# Altium project BQH_DATN_PI4.PrjPcb
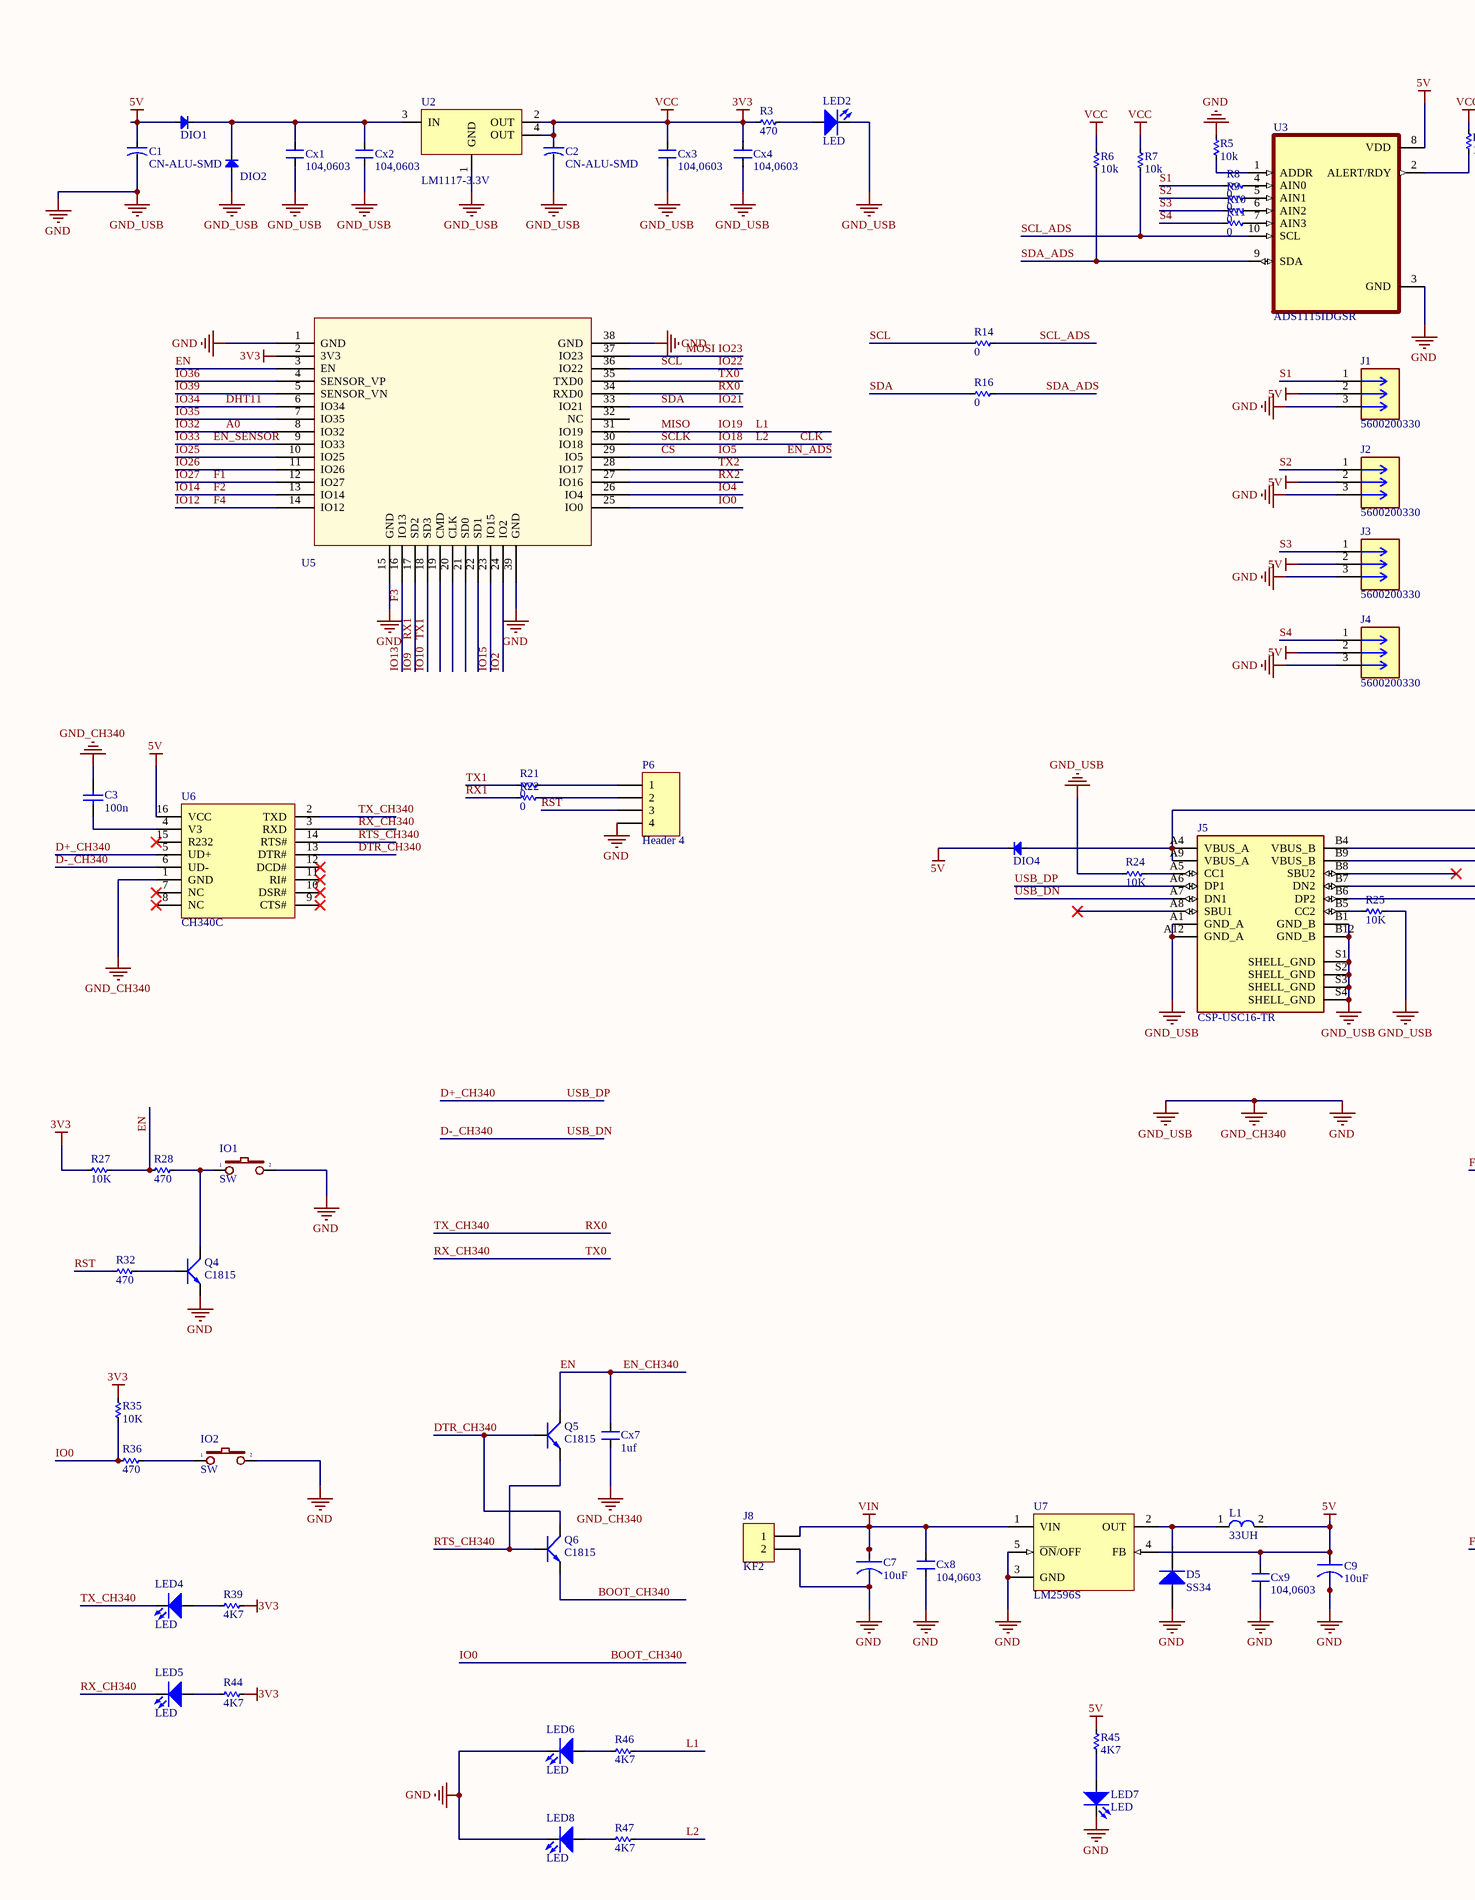
[diagram p0: BQH_DATN_PI4.SchDoc, left]
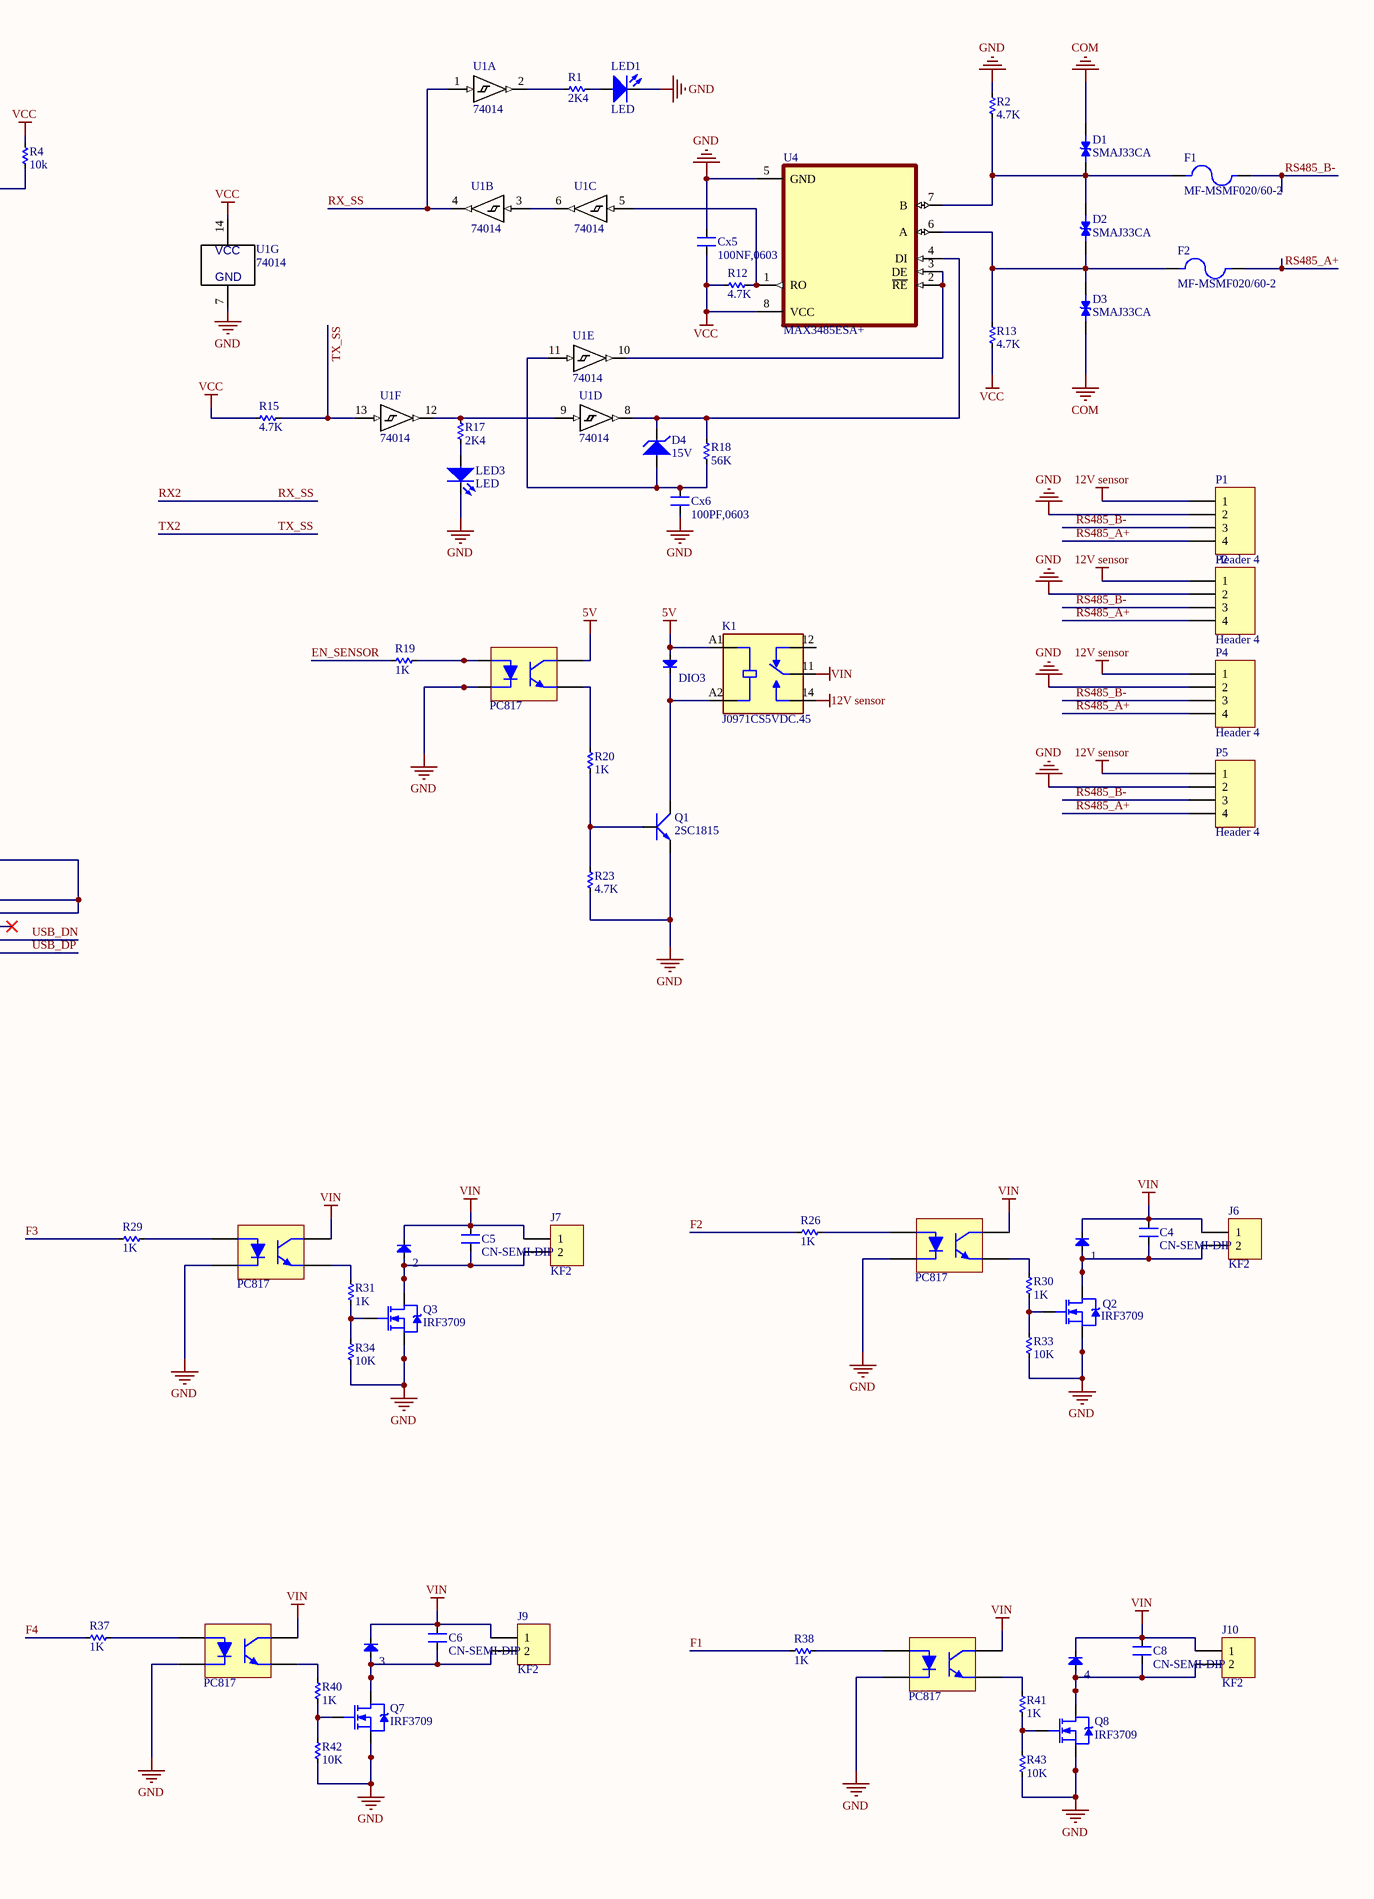
[diagram p1: BQH_DATN_PI4.SchDoc, right]
1 sheet, 127 parts. Net scope: global (net labels, ports and power ports of the same name join across sheets).
Board file: BQH_DATN_PI4.PcbDoc

## Sheet BQH_DATN_PI4.SchDoc
size A2

### Parts
1  Diode SMD  [DIO-SMD-A]  (value not drawn)
2  Diode SMD  [DIO-SMD-A]  (value not drawn)
3  Diode SMD  [DIO-SMD-A]  (value not drawn)
4  Diode SMD  [DIO-SMD-A]  (value not drawn)
C1  CN-ALU-SMD  [CAP-ALU-SMD-6.3x7.7x2.2]
C2  CN-ALU-SMD  [CAP-ALU-SMD-6.3x7.7x2.2]
C3  100n  [CAP SMD 0805.CAOVANHUONG]
C4  CN-SEMI-DIP  [C-SE-10x13x12x6x4]
C5  CN-SEMI-DIP  [C-SE-10x13x12x6x4]
C6  CN-SEMI-DIP  [C-SE-10x13x12x6x4]
C7  10uF  [CAP 8x11.5x3.5mm.CAOVANHUONG]
C8  CN-SEMI-DIP  [C-SE-10x13x12x6x4]
C9  10uF  [CAP 8x11.5x3.5mm.CAOVANHUONG]
Cx1  104,0603  [CN-SMD-3225]
Cx2  104,0603  [CN-SMD-0805]
Cx3  104,0603  [CN-SMD-3225]
Cx4  104,0603  [CN-SMD-0805]
Cx5  100NF,0603  [CN-SMD-0805]
Cx6  100PF,0603  [CN-SMD-0805]
Cx7  1uf  [CN-SMD-0805]
Cx8  104,0603  [CN-SMD-3225]
Cx9  104,0603  [CN-SMD-3225]
D1  SMAJ33CA  [DIOM4325X250N]
D2  SMAJ33CA  [DIOM4325X250N]
D3  SMAJ33CA  [DIOM4325X250N]
D4  15V  [SOD80.CAOVANHUONG]
D5  SS34  [DIODE SMA]
DIO1  Diode SMD  [DIO-SMD-106]  (value not drawn)
DIO2  Diode SMD  [DIO-SMD-106]  (value not drawn)
DIO3  Diode SMD  [DIO-SMD-106]  (value not drawn)
DIO4  Diode SMD  [DIO-SMD-106]  (value not drawn)
F1  MF-MSMF020/60-2  [FUSER_MF-MSMF020/60-2]
F2  MF-MSMF020/60-2  [FUSER_MF-MSMF020/60-2]
IO1  SW  [SW1-SMD]
IO2  SW  [SW1-SMD]
J1  5600200330  [CONN03_560020_MOL]
J2  5600200330  [CONN03_560020_MOL]
J3  5600200330  [CONN03_560020_MOL]
J4  5600200330  [CONN03_560020_MOL]
J5  CSP-USC16-TR  [VALCON_CSP-USC16-TR]
J6  KF2  [KF2-7.62]
J7  KF2  [KF2-7.62]
J8  KF2  [KF2-7.62]
J9  KF2  [KF2-7.62]
J10  KF2  [KF2-7.62]
K1  J0971CS5VDC.45  [RELAY_J0971CS5VDC.45]
L1  33UH  [L-SMD-M-7.3x4.5]
LED1  LED  [LED SMD 0603 RED.CAOVANHUONG]
LED2  LED  [LED SMD 0805 RED witch hole.CAOVANHUONG]
LED3  LED  [LED SMD 0603 RED.CAOVANHUONG]
LED4  LED  [LED SMD 0603 RED.CAOVANHUONG]
LED5  LED  [LED SMD 0603 RED.CAOVANHUONG]
LED6  LED  [LED SMD 0603 RED.CAOVANHUONG]
LED7  LED  [LED SMD 0805 YEL.CAOVANHUONG]
LED8  LED  [LED SMD 0603 RED.CAOVANHUONG]
P1  Header 4  [PCB HEADER 4PIN.CAOVANHUONG]
P2  Header 4  [PCB HEADER 4PIN.CAOVANHUONG]
P3  PC817  [PC817S.CAOVANHUONG]
P4  Header 4  [PCB HEADER 4PIN.CAOVANHUONG]
P5  Header 4  [PCB HEADER 4PIN.CAOVANHUONG]
P6  Header 4  [PCB HEADER 4PIN.CAOVANHUONG]
P7  PC817  [PC817S.CAOVANHUONG]
P8  PC817  [PC817S.CAOVANHUONG]
P9  PC817  [PC817S.CAOVANHUONG]
P10  PC817  [PC817S.CAOVANHUONG]
Q1  2SC1815  [SOT23-321]
Q2  IRF3709  [D2PAK]
Q3  IRF3709  [D2PAK]
Q4  C1815  [SOT23-3.CAOVANHUONG]
Q5  C1815  [SOT23-3.CAOVANHUONG]
Q6  C1815  [SOT23-3.CAOVANHUONG]
Q7  IRF3709  [D2PAK]
Q8  IRF3709  [D2PAK]
R1  2K4  [RES-SMD-0805]
R2  4.7K  [RES-SMD-0805]
R3  470  [RES-SMD-0805]
R4  10k  [RES-SMD-0805]
R5  10k  [RES-SMD-0805]
R6  10k  [RES-SMD-0805]
R7  10k  [RES-SMD-0805]
R8  0  [RES-SMD-0805]
R9  0  [RES-SMD-0805]
R10  0  [RES-SMD-0805]
R11  0  [RES-SMD-0805]
R12  4.7K  [RES-SMD-0805]
R13  4.7K  [RES-SMD-0805]
R14  0  [RES-SMD-0805]
R15  4.7K  [RES-SMD-0805]
R16  0  [RES-SMD-0805]
R17  2K4  [RES-SMD-0805]
R18  56K  [RES-SMD-0805]
R19  1K  [RES-SMD-0805]
R20  1K  [RES-SMD-0805]
R21  0  [RES-SMD-0805]
R22  0  [RES-SMD-0805]
R23  4.7K  [RES-SMD-0805]
R24  10K  [RES-SMD-0805]
R25  10K  [RES-SMD-0805]
R26  1K  [RES-SMD-0805]
R27  10K  [RES-SMD-0805]
R28  470  [RES-SMD-0805]
R29  1K  [RES-SMD-0805]
R30  1K  [RES-SMD-0805]
R31  1K  [RES-SMD-0805]
R32  470  [RES-SMD-0603]
R33  10K  [RES-SMD-0805]
R34  10K  [RES-SMD-0805]
R35  10K  [RES-SMD-0805]
R36  470  [RES-SMD-0805]
R37  1K  [RES-SMD-0805]
R38  1K  [RES-SMD-0805]
R39  4K7  [RES-SMD-0805]
R40  1K  [RES-SMD-0805]
R41  1K  [RES-SMD-0805]
R42  10K  [RES-SMD-0805]
R43  10K  [RES-SMD-0805]
R44  4K7  [RES-SMD-0805]
R45  4K7  [RES-SMD-0805]
R46  4K7  [RES-SMD-0805]
R47  4K7  [RES-SMD-0805]
U1  74014  [SO14]  (parts A,B,C,D,E,F,G of 7)
U2  LM1117-3.3V  [SOT223-4.CAOVANHUONG]
U3  ADS1115IDGSR  [SOP50P490X110-10N]
U4  MAX3485ESA+  [SOIC127P600X175-8N]
U5  ESP32-WROOM-32  [ESP32-WROOM-32D]  (value not drawn)
U6  CH340C  [SOIC16_50_284_25X90_SMT]
U7  LM2596S  [TO263-5.CAOVANHUONG]

### Nets
3V3: C2.1 Cx3.2 Cx4.2 Cx5.1 R3.2 R4.2 R6.2 R7.2 R12.1 R13.2 R15.1 R27.1 R35.1 R39.2 R44.2 U1.14(VCC) U2.2(OUT) U2.4(OUT) U4.8(VCC) U5.2(3V3)  [also labelled VCC]
5V: C1.1 C9.1 Cx9.2 DIO1.1(A) DIO3.1(A) DIO4.2(K) J1.2 J2.2 J3.2 J4.2 K1.A1(COIL1) L1.2 P3.4 R45.2 U3.8(VDD) U6.16(VCC) U7.4(FB)
12V sensor: K1.14(NO) P1.1 P2.1 P4.1 P5.1
COM: D1.2 D3.1
GND: C1.2 C2.2 C3.1 C7.2 C9.2 Cx1.1 Cx2.1 Cx3.1 Cx4.1 Cx5.2 Cx6.2 Cx7.2 Cx8.1 Cx9.1 D5.1(A) DIO2.1(A) IO1.2 IO2.2 J1.3 J2.3 J3.3 J4.3 J5.A1(GND_A) J5.A12(GND_A) J5.B1(GND_B) J5.B12(GND_B) J5.S1(SHELL_GND) J5.S2(SHELL_GND) J5.S3(SHELL_GND) J5.S4(SHELL_GND) J8.2 LED1.2 LED2.2 LED3.2 LED6.2 LED7.2 LED8.2 P1.2 P2.2 P3.2 P4.2 P5.2 P6.4 P7.2 P8.2 P9.2 P10.2 Q1.1(E) Q2.3(S) Q3.3(S) Q4.2(E) Q7.3(S) Q8.3(S) R2.1 R5.2 R23.2 R24.1 R25.2 R33.2 R34.2 R42.2 R43.2 U1.7(GND) U2.1(GND) U3.3(GND) U4.5(GND) U5.1(GND) U5.15(GND) U5.38(GND) U5.39(GND) U6.1(GND) U7.3(GND) U7.5(~{ON}/OFF)  [also labelled GND_CH340, GND_USB]
VIN: 1.2(K) 2.2(K) 3.2(K) 4.2(K) C4.1 C5.1 C6.1 C7.1 C8.1 Cx8.2 J6.1 J7.1 J8.1 J9.1 J10.1 K1.11(COM) P7.4 P8.4 P9.4 P10.4 U7.1(VIN)
A0: U5.8(IO32)  [also labelled IO32]
BOOT_CH340: Q6.2(E) R35.2 R36.2 U5.25(IO0)  [also labelled IO0]
CLK: R47.2 U5.30(IO18)  [also labelled IO18, L2, SCLK]
CS: U5.29(IO5)  [also labelled EN_ADS, IO5]
D+_CH340: J5.A6(DP1) J5.B6(DP2) U6.5(UD+)  [also labelled USB_DP]
D-_CH340: J5.A7(DN1) J5.B7(DN2) U6.6(UD-)  [also labelled USB_DN]
DHT11: U5.6(IO34)  [also labelled IO34]
DTR_CH340: Q5.1(B) Q6.3(C) U6.13(DTR#)
EN: Cx7.1 Q5.3(C) R27.2 R28.1 U5.3(EN)  [also labelled EN_CH340]
EN_SENSOR: R19.2 U5.9(IO33)  [also labelled IO33]
F1: R38.1 U5.12(IO27)  [also labelled IO27]
F2: R26.1 U5.13(IO14)  [also labelled IO14]
F3: R29.1 U5.16(IO13)  [also labelled IO13]
F4: R37.1 U5.14(IO12)  [also labelled IO12]
IO2: U5.24(IO2)
IO4: U5.26(IO4)
IO9: R22.2 U5.17(SD2)  [also labelled RX1]
IO10: R21.2 U5.18(SD3)  [also labelled TX1]
IO15: U5.23(IO15)
IO19: R46.2 U5.31(IO19)  [also labelled L1, MISO]
IO21: R16.2 U5.33(IO21)  [also labelled SDA]
IO22: R14.2 U5.36(IO22)  [also labelled SCL]
IO23: U5.37(IO23)  [also labelled MOSI]
IO25: U5.10(IO25)
IO26: U5.11(IO26)
IO35: U5.7(IO35)
IO36: U5.4(SENSOR_VP)
IO39: U5.5(SENSOR_VN)
RS485_A+: F2.2 P1.4 P2.4 P4.4 P5.4
RS485_B-: F1.2 P1.3 P2.3 P4.3 P5.3
RST: P6.3 R32.1
RTS_CH340: Q5.2(E) Q6.1(B) U6.14(RTS#)
RX0: LED4.2 U5.34(RXD0) U6.2(TXD)  [also labelled TX_CH340]
RX2: U1.1(A) U1.4(Y) U5.27(IO16)  [also labelled RX_SS]
RX_CH340: LED5.2 U5.35(TXD0) U6.3(RXD)  [also labelled TX0]
S1: J1.1 R8.2
S2: J2.1 R9.2
S3: J3.1 R10.2
S4: J4.1 R11.2
SCL_ADS: R7.1 R14.1 U3.10(SCL)
SDA_ADS: R6.1 R16.1 U3.9(SDA)
TX2: R15.2 U1.13(A) U5.28(IO17)  [also labelled TX_SS]
Net1_1: 1.1(A) C4.2 J6.2 Q2.2(D)
Net2_1: 2.1(A) C5.2 J7.2 Q3.2(D)
Net3_1: 3.1(A) C6.2 J9.2 Q7.2(D)
Net4_1: 4.1(A) C8.2 J10.2 Q8.2(D)
NetC3_2: C3.2 U6.4(V3)
NetCx1_2: Cx1.2 Cx2.2 DIO1.2(K) DIO2.2(K) U2.3(IN)
NetCx6_1: Cx6.1 D4.1 R18.2 U1.11(A)
NetD1_1: D1.1 D2.2 F1.1 R2.2 U4.7(B)
NetD2_1: D2.1 D3.2 F2.1 R13.1 U4.6(A)
NetD4_2: D4.2 R18.1 U1.8(Y) U4.4(DI)
NetD5_2: D5.2(K) L1.1 U7.2(OUT)
NetDIO3_2: DIO3.2(K) K1.A2(COIL2) Q1.2(C)
NetDIO4_1: DIO4.1(A) J5.A4(VBUS_A) J5.A9(VBUS_A) J5.B4(VBUS_B) J5.B9(VBUS_B)
NetIO1_1: IO1.1 Q4.3(C) R28.2
NetIO2_1: IO2.1 R36.1
NetJ5_A5: J5.A5(CC1) R24.2
NetJ5_B5: J5.B5(CC2) R25.1
NetLED1_1: LED1.1 R1.2
NetLED2_1: LED2.1 R3.1
NetLED3_1: LED3.1 R17.2
NetLED4_1: LED4.1 R39.1
NetLED5_1: LED5.1 R44.1
NetLED6_1: LED6.1 R46.1
NetLED7_1: LED7.1 R45.1
NetLED8_1: LED8.1 R47.1
NetP3_1: P3.1 R19.1
NetP3_3: P3.3 R20.2
NetP6_1: P6.1 R21.1
NetP6_2: P6.2 R22.1
NetP7_1: P7.1 R26.2
NetP7_3: P7.3 R30.2
NetP8_1: P8.1 R29.2
NetP8_3: P8.3 R31.2
NetP9_1: P9.1 R37.2
NetP9_3: P9.3 R40.2
NetP10_1: P10.1 R38.2
NetP10_3: P10.3 R41.2
NetQ1_3: Q1.3(B) R20.1 R23.1
NetQ2_1: Q2.1(G) R30.1 R33.1
NetQ3_1: Q3.1(G) R31.1 R34.1
NetQ4_1: Q4.1(B) R32.2
NetQ7_1: Q7.1(G) R40.1 R42.1
NetQ8_1: Q8.1(G) R41.1 R43.1
NetR1_1: R1.1 U1.2(Y)
NetR4_1: R4.1 U3.2(ALERT/RDY)
NetR5_1: R5.1 U3.1(ADDR)
NetR8_1: R8.1 U3.4(AIN0)
NetR9_1: R9.1 U3.5(AIN1)
NetR10_1: R10.1 U3.6(AIN2)
NetR11_1: R11.1 U3.7(AIN3)
NetR12_2: R12.2 U1.5(A) U4.1(RO)
NetR17_1: R17.1 U1.9(A) U1.12(Y)
NetU1_3: U1.3(A) U1.6(Y)
NetU1_10: U1.10(Y) U4.2(~{RE}) U4.3(DE)

Not connected (* = marked no-connect by the designer): J5 A8(SBU1)* B8(SBU2)*; K1 12(NC); U5 19(CMD) 20(CLK) 21(SD0) 22(SD1) 32(NC); U6 7(NC)* 8(NC)* 9(CTS#)* 10(DSR#)* 11(RI#)* 12(DCD#)* 15(R232)*

### Library data of the parts
1-4 DIO1-DIO4 = Diode SMD: Default Diode; Code - JEDEC: DO-214-AB; Value: 1N5007; Published: 8-Jun-2000; Revision: July-2002: Re-released for DXP Platform.; Publisher: Altium Limited
C1 C2 = CN-ALU-SMD: Polarized Capacitor (Axial); Published: 8-Jun-2000; LatestRevisionDate: 17-Jul-2002; LatestRevisionNote: Re-released for DXP Platform.; PackageReference: POLAR0.8; Publisher: Altium Limited
C3 = Capacitor NP: Ceramic capacitor; Value: 10uF/50V; Pricing: *; Part Number: *
C4-C6 C8 = CN-SEMI-DIP: Capacitor (Semiconductor SIM Model); Value: 104; LatestRevisionDate: 17-Jul-2002; LatestRevisionNote: Re-released for DXP Platform.; PackageReference: C1206; Publisher: Altium Limited
C7 C9 = Capacitor: Alumium capacitor; Value: 10uF/50V; Part Number: *; Pricing: *
Cx1-Cx9 = CN: Value: 33pF
D1-D3 = SMAJ33CA: 69.7V Clamp 33A (8/20Âµs) Ipp Tvs Diode Surface Mount SMA (DO-214AC); MF: STMicroelectronics; MP: SMAJ33CA-TR; Check_prices: https://www.snapeda.com/parts/SMAJ33CA-TR/STMicroelectronics/view-part/?ref=eda; Purchase-URL: https://pricing.snapeda.com/search/part/SMAJ33CA-TR/?ref=eda; Price: None; SnapEDA_Link: https://www.snapeda.com/parts/SMAJ33CA-TR/STMicroelectronics/view-part/?ref=snap; Availability: In Stock; Package: DO-214 STMicroelectronics; Value: *
D4 = Diode Zener: Part Number: BZV55-C5V1; Pricing: *
D5 = Diode SS34 ( 1N5822 ): Dán; Don_Vi: Con; Ma_Hang: MH002104; Ten_Linh_Kien: Diode SS34 3A 40V SMA ( 1N5822 SS34A); Kieu_Chan: *; Chung_Loai: Dán
F1 F2 = MF-MSMF020/60-2: Polymeric PTC Resettable Fuse 60V 200mA Ih Surface Mount 1812 (4532 Metric), Concave; MF: Bourns; Purchase-URL: https://pricing.snapeda.com/search/part/MF-MSMF020/60-2/?ref=eda; Value: *; Package: 1812 Bourns; Check_prices: https://www.snapeda.com/parts/MF-MSMF020/60-2/Bourns/view-part/?ref=eda; Price: None; Availability: In Stock; MP: MF-MSMF020/60-2; SnapEDA_Link: https://www.snapeda.com/parts/MF-MSMF020/60-2/Bourns/view-part/?ref=snap
IO1 IO2 = SW2: Switch button 2 pin; Value: SW chip 2 pin
J5 = CSP-USC16-TR: CSP-USC16-TR Valcon USB Type C Surface Mount PCB Socket; SnapEDA_Link: https://www.snapeda.com/parts/CSP-USC16-TR/Valcon/view-part/?ref=snap; MF: Valcon; MP: CSP-USC16-TR; Availability: In Stock; Price: None; Value: *; Check_prices: https://www.snapeda.com/parts/CSP-USC16-TR/Valcon/view-part/?ref=eda; Package: None; Purchase-URL: https://pricing.snapeda.com/search/part/CSP-USC16-TR/?ref=eda
J6-J10 = KF2: Manufacturer: Würth Elektronik eiSos GmbH; partNo: 691103110002; ComponentLink1 Description: Manufacturer; ComponentLink2 Description: Datasheet; NoPins: 2; Created Date: 29 October 2013; ComponentLink1URL: http://www.we-online.com; ComponentLink2URL: http://katalog.we-online.de/em/datasheet/6911031100xx.pdf; Created by: Karrer Zheng
K1 = J0971CS5VDC.45: General Purpose Relay SPDT (1 Form C) 5VDC Coil Through Hole; MF: CIT Relay and Switch; Value: *; SnapEDA_Link: https://www.snapeda.com/parts/J0971CS5VDC.45/CIT+Relay+%2526+Switch/view-part/?ref=snap; MP: J0971CS5VDC.45; Purchase-URL: https://pricing.snapeda.com/search/part/J0971CS5VDC.45/?ref=eda; Check_prices: https://www.snapeda.com/parts/J0971CS5VDC.45/CIT+Relay+%2526+Switch/view-part/?ref=eda; Availability: In Stock; Price: None; Package: None
L1 = L-SMD-1: partNo: 78477010; Manufacturer: Wurth Elektronik; Inductance: 1.0 μH; ComponentLink1Description: Manufacturer; ComponentLink1URL: http://www.we-online.de; Created by: Baojun Chen; Created Date: Nov.2015; ComponentLink2Description: Datasheet; ComponentLink2URL: http://katalog.we-online.de/pbs/datasheet/78477010.pdf
LED1-LED8 = LED: LED Single; Value: LED 3 ly Single Colour
P1 P2 P4-P6 = Header 4: Header, 4-Pin; LatestRevisionDate: 17-Jul-2002; LatestRevisionNote: Re-released for DXP Platform.; Publisher: Altium Limited
P3 P7-P10 = PC817: NPN PHOTO General Purpose Amplifier; Published: 8-Jun-2000; LatestRevisionDate: 15-Jan-2003; LatestRevisionNote: PCB Footprint 'BCY-W3/D4.7' replaced; DatasheetDocument: 1997; PackageReference: TO-92A; Publisher: Altium Limited; Code_JEDEC: TO-92A
Q1 = 2SC1815: NPN 600mW, ECB; Value: C1815
Q2 Q3 Q7 Q8 = IRF3709S SMD: N-Channel Power MOSFET
Q4-Q6 = C1815: NPN Transistor, Ic=150mA; Value: C1815
R1-R47 = Res-SMD: Resistor; Manufacturer: Generic Components; Class: Passive; Published: 08/06/2000; Publisher: Altium Hobart Technology Centre
U1 = 74HC7014: IC, Hex Schmitttrigger Buffer, SO-14
U2 = LM1117: 800mA Low-Dropout Linear Regulator; Creator: Nguyen Ba Bien; Website: http://group3i.net
U3 = ADS1115IDGSR: MP: altium_native_batch; Package: None; Price: None; Availability: Unavailable; Value: *
U4 = MAX3485ESA+: 1/1 Transceiver Half RS422, RS485 8-SOIC; MF: Maxim Integrated; Package: SOIC-8 Maxim; Price: None; SnapEDA_Link: https://www.snapeda.com/parts/MAX3485ESA%2B/Maxim%20Integrated/view-part/225576/?ref=snap; Availability: Unavailable; Value: *; MP: MAX3485ESA+
U5 = ESP32-WROOM-32: ESP32; Manufacturer: Espressif Inc.; Reviewer: Fenrrich; ComponentLink1Description: Datasheet; ComponentLink1URL: https://www.espressif.com/sites/default/files/documentation/esp32-wroom-32_datasheet_en.pdf; Publisher: Cynetik Group; Part Number: ESP32-WROOM-32; Data Reviewer: 03-May-2019
U6 = CH340C: USB Bridge, USB to UART USB 2.0 UART Interface; Manufacturer: Olimex; Alternate Part Number-1: NA; Manufacturer Part Number: CH340C; Case/Package: SOIC16; Supplier-1: LCSC; Supplier Part Number-1: C84681
U7 = LM2596: SIMPLE SWITCHER; 3A Step-Down Voltage Regulator; PartNumber: LM2596S-5.0; Manufacturer: National Semiconductor; PowerWise: N; FirstPublished: 4-Dec-2008; DatasheetVersion: Aug-2004; PackageVersion: revJ, Jan-1992; PackageReference: T05A; Publisher: Altium Limited; PackageDescription: TO-220, Molded, 5 Lead, Straight; CompType: Switcher; PinCount: 5; DigiKeyPartNumber: LM2576T-5.0-ND; ComponentLink3URL: http://www.national.com/packaging/folders/t05a.html
J1-J4 = 5600200330: Package: None; Price: None; Value: *; MP: 5600200330; Availability: Unavailable